# EAGLE design rpmmeter (EAGLE 7.6.0)
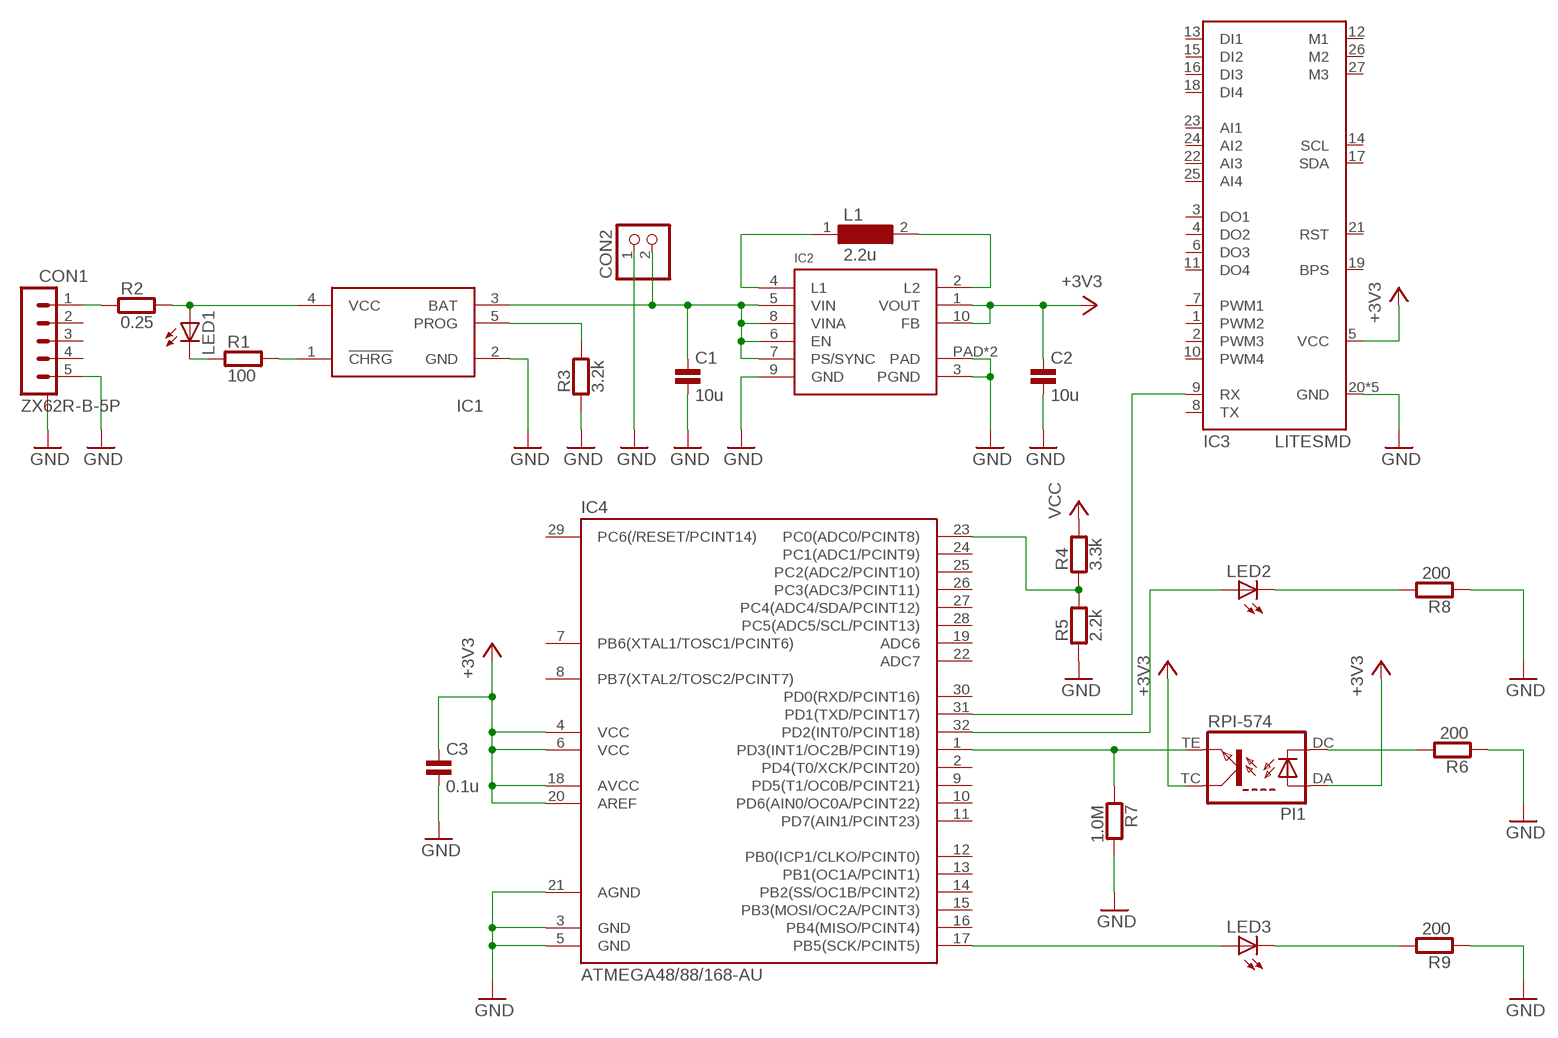
[diagram p0: schematic, sheet 1]

## Parts
C1  10u  C0603  [0603]
C2  10u  C0603  [0603]
C3  0.1u  C0603  [0603]
CON1  ZX62R-B-5P  [MICRO-B]
CON2  JST-PH2  [JST-PH2]
IC1  LTC4054  [TSOT23-5]
IC2  TPS6300XDRCT  [S-PVSON-N10]
IC3  LITESMD  [LITE]
IC4  ATMEGA48/88/168-AU  [TQFP32-08]
L1  2.2u  VLF4012ST  [VLF4012ST]
LED1  LEDSML0603  [SML0603]
LED2  LEDSML0603  [SML0603]
LED3  LEDSML0603  [SML0603]
PI1  RPI-574  [RPI-574]
R1  100  R0603  [0603]
R2  0.25  R0603  [0603]
R3  3.2k  R0603  [0603]
R4  3.3k  R0603  [0603]
R5  2.2k  R0603  [0603]
R6  200  R0603  [0603]
R7  1.0M  R0603  [0603]
R8  200  R0603  [0603]
R9  200  R0603  [0603]

## Nets
+3V3: C2.1 C3.1 IC2.1(VOUT) IC2.10(FB) IC3.5(VCC) IC4.4(VCC) IC4.6(VCC) IC4.18(AVCC) IC4.20(AREF) PI1.DA PI1.TC
GND: C1.2 C2.2 C3.2 CON1.5(1.VBUS) CON1.CASE@1 CON1.CASE@2 CON1.CASE@3 CON1.CASE@4 CON2.1 IC1.2(GND) IC2.3(PGND) IC2.9(GND) IC2.PAD IC2.PAD@1(PAD) IC3.20(GND) IC3.28(GND) IC3.30(GND) IC3.31(GND) IC3.32(GND) IC4.3(GND) IC4.5(GND) IC4.21(AGND) R3.1 R5.1 R6.1 R7.2 R8.1 R9.1
N$1: IC1.4(VCC) LED1.A R2.2
N$2: IC1.1(!CHRG!) R1.2
N$3: LED1.C R1.1
N$4: IC2.4(L1) L1.1
N$5: IC2.2(L2) L1.2
N$6: IC4.23(PC0(ADC0/PCINT8)) R4.1 R5.2
N$7: CON1.1(5.GND) R2.1
N$8: IC4.1(PD3(INT1/OC2B/PCINT19)) PI1.TE R7.1
N$9: IC1.5(PROG) R3.2
N$10: PI1.DC R6.2
N$11: IC4.17(PB5(SCK/PCINT5)) LED3.A
N$12: LED3.C R9.2
N$13: IC4.32(PD2(INT0/PCINT18)) LED2.A
N$14: LED2.C R8.2
U3: IC3.9(RX) IC4.31(PD1(TXD/PCINT17))
VCC: C1.1 CON2.2 IC1.3(BAT) IC2.5(VIN) IC2.6(EN) IC2.7(PS/SYNC) IC2.8(VINA) R4.2
Unconnected: CON1.2(4.ID) CON1.3(3.D+) CON1.4(2.D-) IC3.1(PWM2) IC3.2(PWM3) IC3.3(DO1) IC3.4(DO2) IC3.6(DO3) IC3.7(PWM1) IC3.8(TX) IC3.10(PWM4) IC3.11(DO4) IC3.12(M1) IC3.13(DI1) IC3.14(SCL) IC3.15(DI2) IC3.16(DI3) IC3.17(SDA) IC3.18(DI4) IC3.19(BPS) IC3.21(RST) IC3.22(AI3) IC3.23(AI1) IC3.24(AI2) IC3.25(AI4) IC3.26(M2) IC3.27(M3) IC4.2(PD4(T0/XCK/PCINT20)) IC4.7(PB6(XTAL1/TOSC1/PCINT6)) IC4.8(PB7(XTAL2/TOSC2/PCINT7)) IC4.9(PD5(T1/OC0B/PCINT21)) IC4.10(PD6(AIN0/OC0A/PCINT22)) IC4.11(PD7(AIN1/PCINT23)) IC4.12(PB0(ICP1/CLKO/PCINT0)) IC4.13(PB1(OC1A/PCINT1)) IC4.14(PB2(SS/OC1B/PCINT2)) IC4.15(PB3(MOSI/OC2A/PCINT3)) IC4.16(PB4(MISO/PCINT4)) IC4.19(ADC6) IC4.22(ADC7) IC4.24(PC1(ADC1/PCINT9)) IC4.25(PC2(ADC2/PCINT10)) IC4.26(PC3(ADC3/PCINT11)) IC4.27(PC4(ADC4/SDA/PCINT12)) IC4.28(PC5(ADC5/SCL/PCINT13)) IC4.29(PC6(/RESET/PCINT14)) IC4.30(PD0(RXD/PCINT16))

## Library data of the parts
C1-C3 = untitled:C: CAPACITOR
CON1 = untitled:ZX62R-B-5P
CON2 = rpmmeter_parts:JST-PH2
IC1 = untitled:LTC4054
IC2 = untitled:TPS6300XDRCT
IC3 = untitled:LITE
IC4 = atmega8:ATMEGA48/88/168
L1 = untitled:VLF4012ST
LED1-LED3 = led:LED: LED OSRAM: - CHIPLED LG R971, LG N971, LY N971, LG Q971, LY Q971, LO R971, LY R971 LH N974, LH R974 LS Q976, LO Q976, LY Q976 LO Q996 - Hyper CHIPLED LW Q18S LB Q993, LB Q99A, LB R99A - SideLED LS A670, LO A670, LY A670, LG A670, LP A670 LB A673, LV A673, LT A673, LW A673 LH A674 LY A675 LS A676, LA A676, LO A676, LY A676, LW A676 LS A679, LY A679, LG A679 - Hyper Micro SIDELED® LS Y876, LA Y876, LO Y876, LY Y876 LT Y87S - SmartLED LW L88C, LW L88S LB L89C, LB L89S, LG L890 LS L89K, LO L89K, LY L89K LS L896, LA L896, LO L896, LY L896 - TOPLED LS T670, LO T670, LY T670, LG T670, LP T670 LSG T670, LSP T670, LSY T670, LOP T670, LYG T670 LG T671, LOG T671, LSG T671 LB T673, LV T673, LT T673, LW T673 LH T674 LS T676, LA T676, LO T676, LY T676, LB T676, LH T676, LSB T676, LW T676 LB T67C, LV T67C, LT T67C, LS T67K, LO T67K, LY T67K, LW E67C LS E67B, LA E67B, LO E67B, LY E67B, LB E67C, LV E67C, LT E67C LW T67C LS T679, LY T679, LG T679 LS T770, LO T770, LY T770, LG T770, LP T770 LB T773, LV T773, LT T773, LW T773 LH T774 LS E675, LA E675, LY E675, LS T675 LS T776, LA T776, LO T776, LY T776, LB T776 LHGB T686 LT T68C, LB T68C - Hyper Mini TOPLED® LB M676 - Mini TOPLED Santana® LG M470 LS M47K, LO M47K, LY M47K Source: http://www.osram.convergy.de LUXEON: - LUMILED® LXK2-PW12-R00, LXK2-PW12-S00, LXK2-PW14-U00, LXK2-PW14-V00 LXK2-PM12-R00, LXK2-PM12-S00, LXK2-PM14-U00 LXK2-PE12-Q00, LXK2-PE12-R00, LXK2-PE12-S00, LXK2-PE14-T00, LXK2-PE14-U00 LXK2-PB12-K00, LXK2-PB12-L00, LXK2-PB12-M00, LXK2-PB14-N00, LXK2-PB14-P00, LXK2-PB14-Q00 LXK2-PR12-L00, LXK2-PR12-M00, LXK2-PR14-Q00, LXK2-PR14-R00 LXK2-PD12-Q00, LXK2-PD12-R00, LXK2-PD12-S00 LXK2-PH12-R00, LXK2-PH12-S00 LXK2-PL12-P00, LXK2-PL12-Q00, LXK2-PL12-R00 Source: www.luxeon.com KINGBRIGHT: KA-3528ASYC Source: www.kingbright.com
PI1 = RPI-574:RPI-574: Photointerrupter
R1-R9 = untitled:R: RESISTOR

## Board
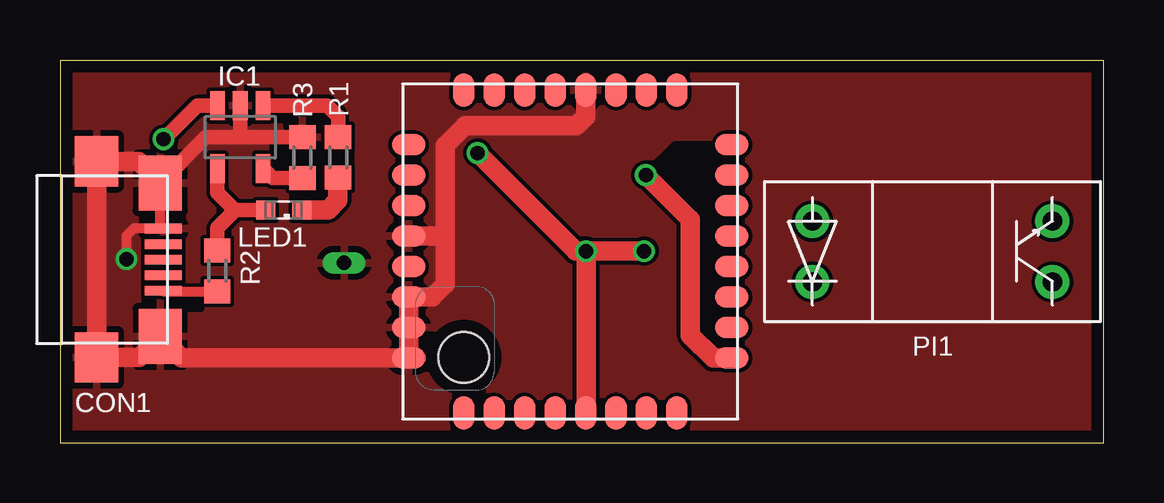
[diagram p1: board, top side]
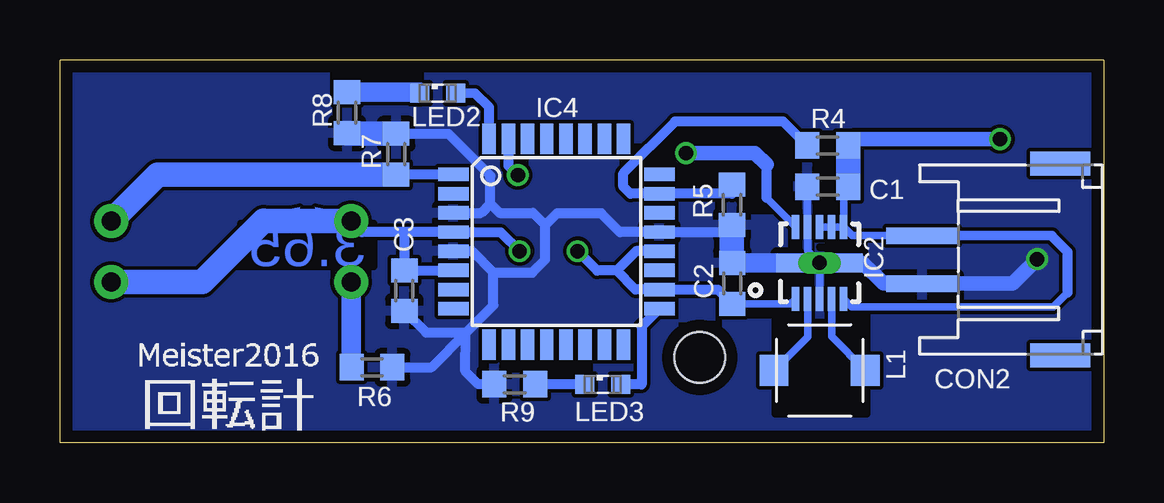
[diagram p2: board, bottom side, seen from below]

Size 43.48 x 15.98 mm. Coordinates in mm from the lower left corner, seen from the top.
Outline: 43.48,0 43.48,15.98 0,15.98 0,0 43.48,0
Copper layers (1*16): Top 0.035mm / dielectric 1.6mm / Bottom 0.035mm
Design rules "Elecrow_2-layer_PCB_eagle_rule": minimum track width 6mil, minimum drill 12mil, track to track 6mil, track to pad 6mil, pad to pad 6mil, via to via 8mil, smd to smd 0mil, copper to edge 20mil, drill to drill 10mil, minimum pad ring 6mil, minimum via ring 6mil, stop-mask expansion 0mil, vias tented up to drill 100mil, thermal gap 10mil
Holes 2.1 mm at 16.82,3.57
tRestrict: area 24.4,3.6 to 28.1,12.4; area 8.9,11.4 to 12.1,12.4; area 5,5.6 to 5.9,6.1; area 8.8,13.5 to 9.8,13.9
bRestrict: area 9.9,1.2 to 13.7,5; area 21.4,2.8 to 23.3,3.5; area 12.9,10.3 to 18.2,13.1; area 13.8,9.7 to 14.9,11.2; area 13.1,6 to 15.6,7; area 9.5,5.9 to 10.7,6.9; area 13,5.3 to 14.8,5.7; area 11,10.3 to 12,12.9; area 11.3,8.2 to 11.8,8.2

### Footprints (pad centres in the part's own frame; a part is rotated, then mirrored left to right if it is on the bottom)
0603 = smd 1 x 1.1: 1 -0.85,0; 2 0.85,0
MICRO-B = smd 0.4 x 1.55: 1 1.3,2.775; 2 0.65,2.775; 3 0,2.775; 4 -0.65,2.775; 5 -1.3,2.775 | smd 2.3 x 1.8: CASE@1 -3.2,2.65; CASE@2 3.2,2.65 | smd 2.1 x 1.8: CASE@3 -4.1,0; CASE@4 4.075,0
JST-PH2 = smd 0.7 x 3: 1 1,-3.7; 2 -1,-3.7 | smd 1 x 2.5: PAD1 4,2.05; PAD2 -4,2.05
TSOT23-5 = smd 0.62 x 1.22: 1 -0.95,-1.31; 2 0,-1.31; 3 0.95,-1.31; 4 0.95,1.31; 5 -0.95,1.31
S-PVSON-N10 = smd 0.3 x 1: 1 -1,-1.5; 2 -0.5,-1.5; 3 0,-1.5; 4 0.5,-1.5; 5 1,-1.5; 6 1,1.5; 7 0.5,1.5; 8 0,1.5; 9 -0.5,1.5; 10 -1,1.5 | smd 3.6 x 0.8: PAD 0,0 | drill 0.6 long: PAD@1 0,0
LITE = smd 1.4 x 0.9: 1 0.25,11.43; 2 0.25,10.16; 3 0.25,8.89; 4 0.25,7.62; 5 0.25,6.35; 6 0.25,5.08; 7 0.25,3.81; 8 0.25,2.54; 17 13.72,2.54; 18 13.72,3.81; 19 13.72,5.08; 20 13.72,6.35; 21 13.72,7.62; 22 13.72,8.89; 23 13.72,10.16; 24 13.72,11.43 | smd 0.9 x 1.4: 9 2.54,0.25; 10 3.81,0.25; 11 5.08,0.25; 12 6.35,0.25; 13 7.62,0.25; 14 8.89,0.25; 15 10.16,0.25; 16 11.43,0.25; 25 11.43,13.72; 26 10.16,13.72; 27 8.89,13.72; 28 7.62,13.72; 29 6.35,13.72; 30 5.08,13.72; 31 3.81,13.72; 32 2.54,13.72
TQFP32-08 = smd 1.27 x 0.559: 1 -4.293,2.8; 2 -4.293,2; 3 -4.293,1.2; 4 -4.293,0.4; 5 -4.293,-0.4; 6 -4.293,-1.2; 7 -4.293,-2; 8 -4.293,-2.8; 17 4.293,-2.8; 18 4.293,-2; 19 4.293,-1.2; 20 4.293,-0.4; 21 4.293,0.4; 22 4.293,1.2; 23 4.293,2; 24 4.293,2.8 | smd 0.559 x 1.27: 9 -2.8,-4.293; 10 -2,-4.293; 11 -1.2,-4.293; 12 -0.4,-4.293; 13 0.4,-4.293; 14 1.2,-4.293; 15 2,-4.293; 16 2.8,-4.293; 25 2.8,4.293; 26 2,4.293; 27 1.2,4.293; 28 0.4,4.293; 29 -0.4,4.293; 30 -1.2,4.293; 31 -2,4.293; 32 -2.8,4.293
VLF4012ST = smd 1.2 x 1.3: 1 1.9,0; 2 -1.9,0
SML0603 = smd 0.8 x 0.8: A 0.75,0; C -0.75,0
RPI-574 = drill 0.8 pad 1.422: DA 0,0; DC 0,-2.54; TC 10,-2.54; TE 10,0

### Placement (x,y rotation side)
C1  11.49,10.69 180 bottom
C2  15.47,6.65 90 bottom
C3  29.13,6.36 270 bottom
CON1  1.52,7.65 270 top
CON2  3.86,7.65 270 bottom
IC1  7.51,12.76 180 top
IC2  11.84,7.51 0 bottom
IC3  28.25,1.01 90 top
IC4  22.8,8.4 0 bottom
L1  11.83,3.03 0 bottom
LED1  9.32,9.72 180 top
LED2  27.75,14.59 0 bottom
LED3  20.87,2.45 0 bottom
PI1  31.35,9.26 0 top
R1  11.59,11.92 90 top
R2  6.55,7.18 90 top
R3  10.1,11.9 270 top
R4  11.5,12.41 0 bottom
R5  15.49,9.93 90 bottom
R6  30.49,3.16 180 bottom
R7  29.48,12.05 90 bottom
R8  31.53,13.77 90 bottom
R9  24.54,2.45 0 bottom

### Tracks (layer width: path | path; a pad name or v marks a point on that pad's centre or on a via)
+3V3  (via drill 0.6)
  Top 0.813: IC3.5 21.92,1.26 v21.92,8 | v21.92,8 v24.33,8 | v21.92,8 21.49,8 v17.4,12.09
  Bottom 0.305: IC2.1 13.05,5.8 C2.1 | IC2.10 14.05,10.22
  Bottom 0.406: C2.1 16.07,6.4 IC4.18 19.51,6.4 20.3,7.19 | v21.92,8 21.11,7.19 20.3,7.19 | v24.33,8 25.13,8.8 IC4.4 29.13,8.8 | IC4.20 19.48,8 20.3,7.19 | 14.05,10.22 14.05,11.61 | IC4.6 C3.1 29.13,8.8 | 29.13,8.8 30.89,8.8 PI1.DA
  Bottom 0.61: v17.4,12.09 14.53,12.09 14.05,11.61
  Bottom 1.016: PI1.TC 37.56,6.72 35,9.27 35,9.26 PI1.DA
GND  (via drill 0.6)
  Top 0.406: CON1.CASE@1 4.17,8.95 CON1.5 3.08,8.95 2.77,8.64 v2.77,7.67
  Top 0.61: IC1.2 7.51,12.75 | 7.51,12.75 R3.1 | CON1.CASE@1 6.08,12.75 7.51,12.75
  Top 0.813: CON1.CASE@1 3.27,11.74 CON1.CASE@3 CON1.CASE@4 3.3,3.57 CON1.CASE@2 5.07,3.55 IC3.32 IC3.31 IC3.30 15.52,6.1 16.05,6.63 16.05,8.63 | IC3.20 21.9,13.62 21.51,13.23 16.89,13.23 16.05,12.4 16.05,8.63 | IC3.28 16.05,8.63
  Bottom 0.305: C1.2 IC2.9 12.34,8.01 IC2.PAD@1 IC2.3
  Bottom 0.406: R7.2 27.3,12.9 25.55,11.15 25.55,9.98 | IC4.3 25.93,9.6 25.55,9.98 | R5.1 15.48,8.8 IC4.21 20.15,8.8 20.93,9.58 22.78,9.58 23.27,9.09 | IC4.5 26.31,8 25.43,7.11 | 25.55,9.98 25.17,9.6 23.77,9.6 23.27,9.09 | R9.1 26.05,2.45 26.59,3 26.58,4.58 | 26.58,4.58 26.56,4.6 | 26.56,4.6 25.43,5.74 25.43,7.11 | 25.43,7.11 23.8,7.11 23.27,7.65 23.27,9.09 | R6.1 28,3.16 26.58,4.58 | C3.2 28.23,4.6 26.56,4.6
  Bottom 0.61: IC2.PAD@1 10.03,7.51 9.17,6.66 7.57,6.66 CON2.1 3.79,6.65 v2.77,7.67
  Bottom 0.813: C2.2 IC2.PAD@1 | R8.1 31.53,12.9
  Bottom 1.016: R5.1 15.48,7.5 C2.2 | 31.53,12.9 R7.2
  pour Top: -0.25,16.23 43.66,16.23 43.66,-0.25 -0.25,-0.25
  pour Bottom: -0.25,16.23 43.74,16.23 43.74,-0.25 -0.25,-0.25
N$1
  Top 0.61: R2.2 6.55,8.97 7.29,9.7 7.29,9.72 | LED1.A 7.29,9.72 | IC1.4 6.56,10.45 7.29,9.72
N$2
  Top 0.61: R1.2 11.59,13.61 11.12,14.07 IC1.1
N$3
  Top 0.813: LED1.C 11.17,9.72 11.58,10.13 R1.1
N$4
  Bottom 0.305: IC2.4 11.34,4.44 L1.1
N$5
  Bottom 0.305: IC2.2 12.34,4.43 L1.2
N$6
  Bottom 0.406: 15.48,10.8 R5.2 15.48,10.4 IC4.23 19.72,10.4 20.02,10.69 20.02,11.25 17.86,13.41 13.35,13.41 R4.1
N$7
  Top 0.406: CON1.1 4.3,6.33 R2.1
N$8
  Bottom 0.406: IC4.1 R7.1
  Bottom 1.016: R7.1 39.41,11.2 PI1.TE
N$9
  Top 0.61: IC1.5 8.85,11.05 R3.2
N$10
  Bottom 0.813: PI1.DC R6.2
N$11
  Bottom 0.406: IC4.17 19.25,4.85 19.25,2.45 | 19.25,2.44 19.25,2.45 | 19.25,2.45 LED3.A
N$12
  Bottom 0.406: LED3.C R9.2
N$13
  Bottom 0.406: IC4.32 25.61,14 26.19,14.58 LED2.A
N$14
  Bottom 0.813: LED2.C 28.5,14.62 R8.2
U3  (via drill 0.6)
  Top 0.813: v24.41,11.18 26.26,9.32 26.26,4.5 27.21,3.55 IC3.9
  Bottom 0.406: IC4.31 24.8,11.57 v24.41,11.18
VCC  (via drill 0.6)
  Top 0.61: IC1.3 5.71,14.07 v4.32,12.67
  Bottom 0.305: IC2.8 IC2.7 IC2.6 | IC2.6 10.84,10.49 C1.1 | IC2.6 10.47,8.65 CON2.2 | 1.5,6.27 2.11,5.66 10.49,5.66 IC2.5
  Bottom 0.406: CON2.2 2.16,8.64 1.5,7.98 1.5,6.27
  Bottom 0.61: v4.32,12.67 10.39,12.67 R4.2
  Bottom 1.016: R4.2 C1.1
(copper drawn outside any net)
  shapes: Bottom area x1

### Text on the board
_tNames: IC1 | R3 | R1 | LED1 | R2 | PI1 | CON1
_bNames: IC4 | R4 | LED2 | R8 | C1 | R7 | IC2 | R5 | C3 | C2 | L1 | CON2 | R6 | LED3 | R9